# Altium schematic sheet dac-power.SchDoc: DAC - Power
size Letter; CheckedBy: J. Brinton; CompanyName: Signal Laboratories, Inc.; DrawnBy: J. Brinton; Engineer: J. Brinton; Address1: 3479 Edison Way; Address2: Menlo Park CA 94025; Address3: +1 (877) 778-8435; Address4: siglabs.com; Revision: 3; SheetNumber: 27; SheetTotal: 49
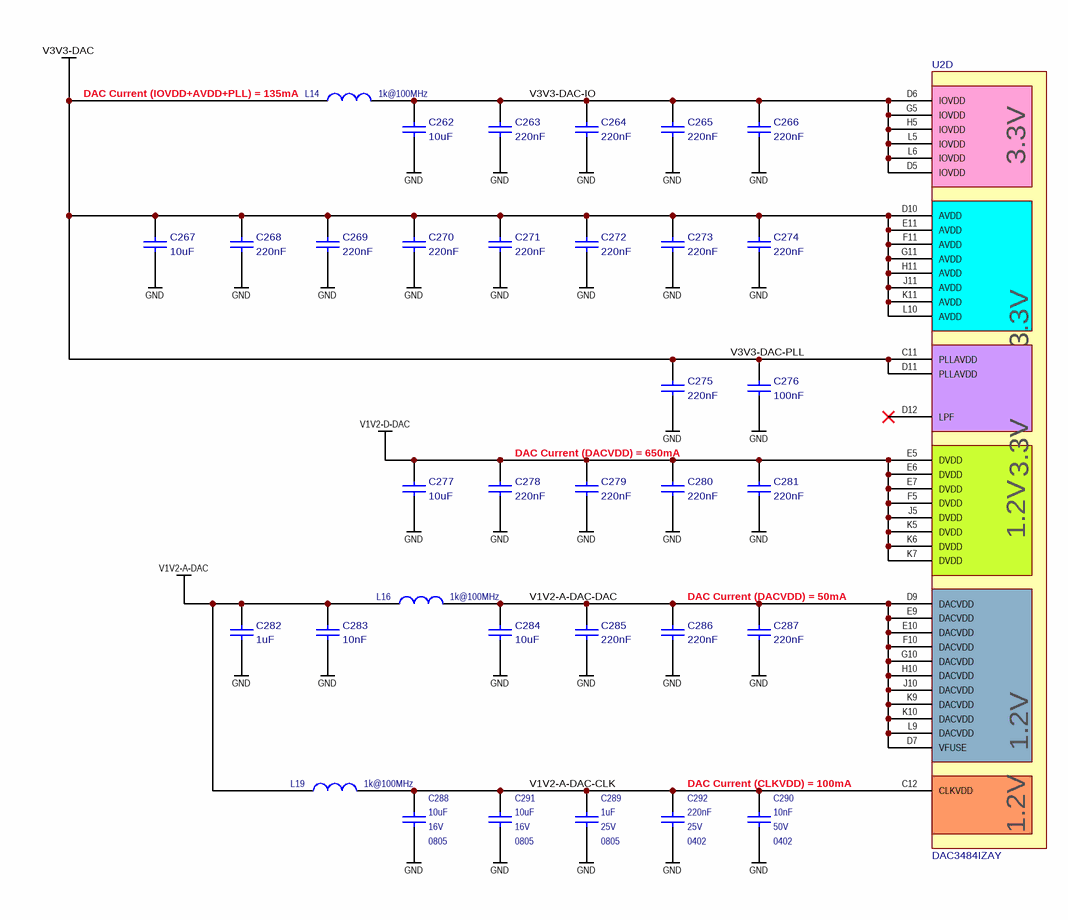
[diagram p0: dac-power.SchDoc]

## Parts
C262  value 10uF  [CAPC200X125X145L45N]  (hidden comment: CL21B106KOQNNNE)
C263  value 220nF  [CAPC100X50X55L25N]  (hidden comment: C1005X7R1E224K050BE)
C264  value 220nF  [CAPC100X50X55L25N]  (hidden comment: C1005X7R1E224K050BE)
C265  value 220nF  [CAPC100X50X55L25N]  (hidden comment: C1005X7R1E224K050BE)
C266  value 220nF  [CAPC100X50X55L25N]  (hidden comment: C1005X7R1E224K050BE)
C267  value 10uF  [CAPC200X125X145L45N]  (hidden comment: CL21B106KOQNNNE)
C268  value 220nF  [CAPC100X50X55L25N]  (hidden comment: C1005X7R1E224K050BE)
C269  value 220nF  [CAPC100X50X55L25N]  (hidden comment: C1005X7R1E224K050BE)
C270  value 220nF  [CAPC100X50X55L25N]  (hidden comment: C1005X7R1E224K050BE)
C271  value 220nF  [CAPC100X50X55L25N]  (hidden comment: C1005X7R1E224K050BE)
C272  value 220nF  [CAPC100X50X55L25N]  (hidden comment: C1005X7R1E224K050BE)
C273  value 220nF  [CAPC100X50X55L25N]  (hidden comment: C1005X7R1E224K050BE)
C274  value 220nF  [CAPC100X50X55L25N]  (hidden comment: C1005X7R1E224K050BE)
C275  value 220nF  [CAPC100X50X55L25N]  (hidden comment: C1005X7R1E224K050BE)
C276  value 100nF  [CAPC100X50X55L25N]  (hidden comment: CC0402KRX7R8BB104)
C277  value 10uF  [CAPC200X125X145L45N]  (hidden comment: CL21B106KOQNNNE)
C278  value 220nF  [CAPC100X50X55L25N]  (hidden comment: C1005X7R1E224K050BE)
C279  value 220nF  [CAPC100X50X55L25N]  (hidden comment: C1005X7R1E224K050BE)
C280  value 220nF  [CAPC100X50X55L25N]  (hidden comment: C1005X7R1E224K050BE)
C281  value 220nF  [CAPC100X50X55L25N]  (hidden comment: C1005X7R1E224K050BE)
C282  value 1uF  [CAPC200X125X145L45N]  (hidden comment: TMK212B7105KG)
C283  value 10nF  [CAPC100X50X55L25N]  (hidden comment: GRM155R71H103KA88)
C284  value 10uF  [CAPC200X125X145L45N]  (hidden comment: CL21B106KOQNNNE)
C285  value 220nF  [CAPC100X50X55L25N]  (hidden comment: C1005X7R1E224K050BE)
C286  value 220nF  [CAPC100X50X55L25N]  (hidden comment: C1005X7R1E224K050BE)
C287  value 220nF  [CAPC100X50X55L25N]  (hidden comment: C1005X7R1E224K050BE)
C288  value 10uF  Voltage: 16V  Package: 0805  [CAPC2012X145N]  (hidden comment: EMK212BB7106MG)
C289  value 1uF  Voltage: 25V  Package: 0805  [CAPC200X125X145L45N]  (hidden comment: TMK212B7105KG)
C290  value 10nF  Voltage: 50V  Package: 0402  [CAPC100X50X55L25N]  (hidden comment: GRM155R71H103KA88)
C291  value 10uF  Voltage: 16V  Package: 0805  [CAPC2012X145N]  (hidden comment: EMK212BB7106MG)
C292  value 220nF  Voltage: 25V  Package: 0402  [CAPC100X50X55L25N]  (hidden comment: C1005X7R1E224K050BE)
L14  value 1k@100MHz  [1806]  (hidden comment: BLM41PG102SN1L)
L16  value 1k@100MHz  [1806]  (hidden comment: BLM41PG102SN1L)
L19  value 1k@100MHz  [1806]  (hidden comment: BLM41PG102SN1L)
U2  DAC3484IZAY  [ZAY-BGA-196]  (part D of 5)

## Nets
GND: C262.2 C263.2 C264.2 C265.2 C266.2 C267.2 C268.2 C269.2 C270.2 C271.2 C272.2 C273.2 C274.2 C275.2 C276.2 C277.2 C278.2 C279.2 C280.2 C281.2 C282.2 C283.2 C284.2 C285.2 C286.2 C287.2 C288.1 C289.1 C290.1 C291.1 C292.1
V1V2-A-DAC: C282.1 C283.1 L16.1 L19.1
V1V2-D-DAC: C277.1 C278.1 C279.1 C280.1 C281.1 U2.E5(DVDD) U2.E6(DVDD) U2.E7(DVDD) U2.F5(DVDD) U2.J5(DVDD) U2.K5(DVDD) U2.K6(DVDD) U2.K7(DVDD)
V3V3-DAC-PLL: C267.1 C268.1 C269.1 C270.1 C271.1 C272.1 C273.1 C274.1 C275.1 C276.1 L14.1 U2.C11(PLLAVDD) U2.D10(AVDD) U2.D11(PLLAVDD) U2.E11(AVDD) U2.F11(AVDD) U2.G11(AVDD) U2.H11(AVDD) U2.J11(AVDD) U2.K11(AVDD) U2.L10(AVDD)  [also labelled V3V3-DAC]
V1V2-A-DAC-CLK: C288.2 C289.2 C290.2 C291.2 C292.2 L19.2 U2.C12(CLKVDD)
V1V2-A-DAC-DAC: C284.1 C285.1 C286.1 C287.1 L16.2 U2.D7(VFUSE) U2.D9(DACVDD) U2.E9(DACVDD) U2.E10(DACVDD) U2.F10(DACVDD) U2.G10(DACVDD) U2.H10(DACVDD) U2.J10(DACVDD) U2.K9(DACVDD) U2.K10(DACVDD) U2.L9(DACVDD)
V3V3-DAC-IO: C262.1 C263.1 C264.1 C265.1 C266.1 L14.2 U2.D5(IOVDD) U2.D6(IOVDD) U2.G5(IOVDD) U2.H5(IOVDD) U2.L5(IOVDD) U2.L6(IOVDD)

Not connected (* = marked no-connect by the designer): U2 D12(LPF)*

## Notes on the sheet
- DAC Current (IOVDD+AVDD+PLL) = 135mA
- DAC Current (DACVDD) = 650mA
- DAC Current (DACVDD) = 50mA
- DAC Current (CLKVDD) = 100mA
- Title
- Engineer
- Revision
- Drawn By
- Checked By
- Date
- Sheet
- of
- (in symbol DAC3484IZAY, part D) 3.3V; 1.2V

## Library data of the parts
C262 C267 C277 C284 = LMK212B7106KG: Ceramic Capacitor 10uF ±10% 16V X7R 0805; Manufacturer: Samsung; Tr: -55:105; Manufacturer P/N: CL21B106KOQNNNE; Tolerance: ±10%; Package: 0805; Voltage: 16V
C263-C266 C268-C275 C278-C281 C285-C287 = TMK105B7224KV: Ceramic Capacitor 220nF ±10% 25V X7R 0402; Manufacturer: TDK; Manufacturer P/N: C1005X7R1E224K050BE; Tolerance: ±10%; Tr: *; Package: 0402; Voltage: 25V
C276 = TMK105B7104KV: Ceramic Capacitor 100nF ±10% 25V X7R 0402; Manufacturer: Yageo; Manufacturer P/N: TMK105B7104KV; Tolerance: ±10%; Tr: *; Package: 0402; Voltage: 25V
C282 = TMK212B7105KG: Ceramic Capacitor 1uF ±10% 25V X7R 0805; Manufacturer: Taiyo Yuden; Manufacturer P/N: TMK212B7105KG; Tolerance: ±10%; Tr: *; Package: 0805; Voltage: 25V
C283 = TMK105B7103KV: Ceramic Capacitor 10nF ±10% 50V X7R 0402; Manufacturer: Murata; Tr: -55:125; Manufacturer P/N: GRM155R71H103KA88; Tolerance: ±10%; Package: 0402; Voltage: 50V
C288 C291 = CAP 0603: Ceramic Capacitor 10uF ±20% 16V X7R 0805; Manufacturer: Taiyo Yuden; Tr: -55:125; Manufacturer P/N: EMK212BB7106MG; Tolerance: ±20%
C289 = CAP 0402: Ceramic Capacitor 1uF ±10% 25V X7R 0805; Manufacturer: Taiyo Yuden; Tr: -55:125; Manufacturer P/N: TMK212B7105KG; Tolerance: ±10%
C290 = CAP 0402: Ceramic Capacitor 10nF ±10% 50V X7R 0402; Manufacturer: Murata; Tr: -55:125; Manufacturer P/N: GRM155R71H103KA88; Tolerance: ±10%
C292 = CAP 0402: Ceramic Capacitor 220nF ±10% 25V X7R 0402; Manufacturer: TDK; Manufacturer P/N: C1005X7R1E224K050BE; Tolerance: ±10%
L14 L16 L19 = INDUCTANCE1: Ferrite Bead 1k@100MHz 1.5A 1806; Manufacturer: Murata; Tr: -55:125; Manufacturer P/N: BLM41PG102SN1L; Package: 1806
U2 = DAC3484IZAY: High Speed Quad DAC, 16-bit, 1.25GSPS; Manufacturer: Texas Instruments; Manufacturer P/N: DAC3484IZAY